# EAGLE design modem_breakout (EAGLE 6.4)
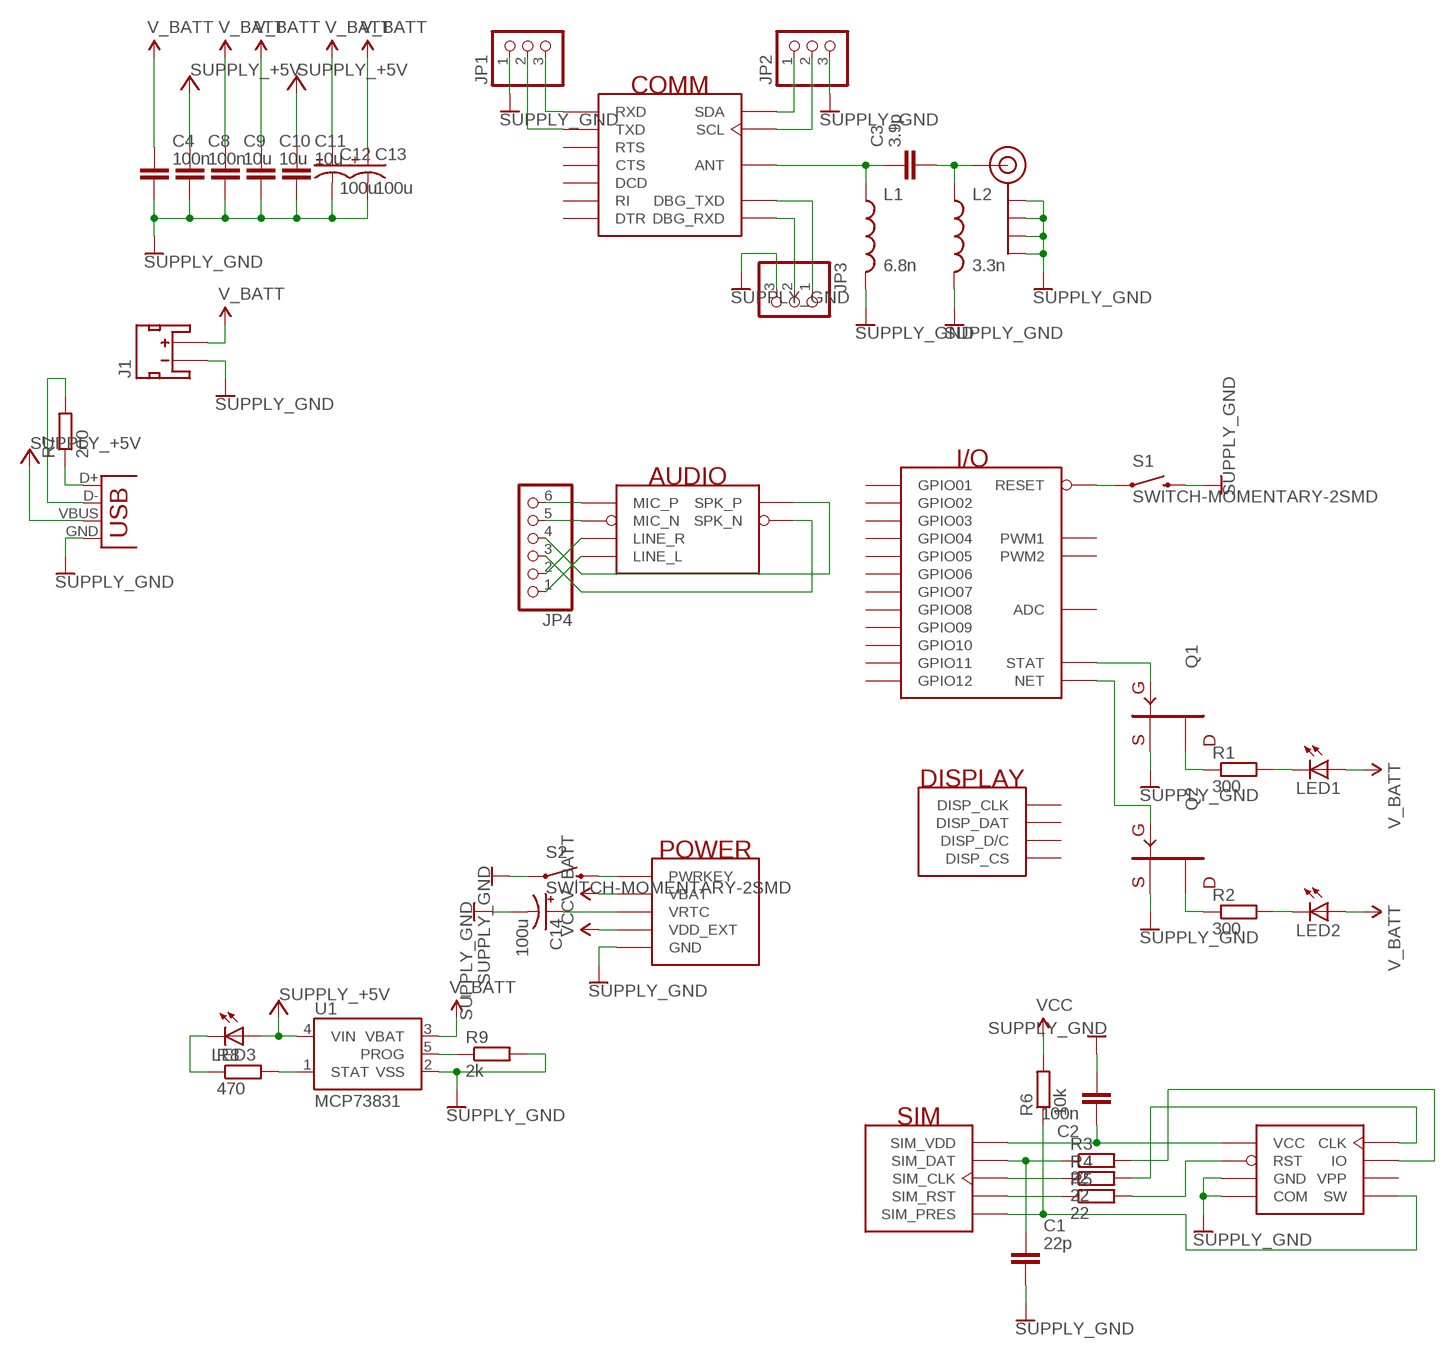
[diagram p0: schematic, sheet 1]

## Parts
C1  22p  CAPACITOR_NPOL-0402  [C402]
C2  100n  CAPACITOR_NPOL-0402  [C402]
C3  3.9p  CAPACITOR_NPOL-0603  [C603]
C4  100n  CAPACITOR_NPOL-0402  [C402]
C8  100n  CAPACITOR_NPOL-0402  [C402]
C9  10u  CAPACITOR_NPOL-0805  [C805]
C10  10u  CAPACITOR_NPOL-0805  [C805]
C11  10u  CAPACITOR_NPOL-0805  [C805]
C12  100u  CAP_POL3528  [EIA3528]
C13  100u  CAP_POL3528  [EIA3528]
C14  100u  CAP_POL3528  [EIA3528]
J1  JST_2MM_MALE  [JST-2-SMD]
J$1  SMA_EDGE  [SMA-EDGE]
JP1  PINHD-1X3  [1X03]
JP2  PINHD-1X3  [1X03]
JP3  PINHD-1X3  [1X03]
JP4  PINHD-1X6  [1X06]
JP5  USB-SMD-NS  [USB-MINIB-NOSTOP]
L1  6.8n  INDUCTOR0603  [0603]
L2  3.3n  INDUCTOR0603  [0603]
LED1  LED-0603  [LED-603]
LED2  LED-0603  [LED-603]
LED3  LED-0603  [LED-603]
Q1  TRANSISTOR_FET-N  [SOT-23]
Q2  TRANSISTOR_FET-N  [SOT-23]
R1  300  RESISTOR-0603  [R603]
R2  300  RESISTOR-0603  [R603]
R3  22  RESISTOR-0402  [R402]
R4  22  RESISTOR-0402  [R402]
R5  22  RESISTOR-0402  [R402]
R6  10k  RESISTOR-0402  [R402]
R7  200  RESISTOR-0603  [R603]
R8  470  RESISTOR-0603  [R603]
R9  2k  RESISTOR-0402  [R402]
S1  SWITCH-MOMENTARY-2SMD  [TACTILE_SWITCH_SMD]
S2  SWITCH-MOMENTARY-2SMD  [TACTILE_SWITCH_SMD]
U1  MCP73831  [SOT23-5]
U$1  SIM900  [SIM900]
U$2  SIM-MICRO  [1041180811]

## Nets
+5V: C8.1 C11.1 JP5.VBUS LED3.A U1.4(VIN) ; supply symbol labelled SUPPLY_+5V
GND: C1.2 C2.2 C4.2 C8.2 C9.2 C10.2 C11.2 C12.C(-) C13.C(-) C14.C(-) J1.1(-) J$1.GND@0(GND) J$1.GND@1(GND) J$1.GND@2(GND) J$1.GND@3(GND) JP1.1 JP2.3 JP3.3 JP5.GND L1.2 L2.2 Q1.2(S) Q2.2(S) R9.2 S1.3 S2.1 U1.2(VSS) U$1.P$17(GND) U$1.P$18(GND) U$1.P$29(GND) U$1.P$39(GND) U$1.P$45(GND) U$1.P$46(GND) U$1.P$53(GND) U$1.P$54(GND) U$1.P$58(GND) U$1.P$59(GND) U$1.P$61(GND) U$1.P$62(GND) U$1.P$63(GND) U$1.P$64(GND) U$1.P$65(GND) U$2.5(GND) U$2.COMMON(COM) U$2.G1(GND) U$2.G2(GND) U$2.G3(GND) U$2.G4(GND) U$2.G5(GND) U$2.G6(GND) ; supply symbol labelled SUPPLY_GND
N$1: JP1.3 U$1.P$10(RXD)
N$2: JP1.2 U$1.P$9(TXD)
N$3: JP2.1 U$1.P$37(SDA)
N$4: JP2.2 U$1.P$38(SCL)
N$5: C3.1 L1.1 U$1.P$60(ANT)
N$6: JP3.1 U$1.P$27(DBG_TXD)
N$7: JP3.2 U$1.P$28(DBG_RXD)
N$8: C3.2 J$1.SIG(SIGNAL) L2.1
N$9: C1.1 R3.1 U$1.P$31(SIM_DAT)
N$10: R6.1 U$1.P$34(SIM_PRES) U$2.DETECT(SW)
N$11: R4.1 U$1.P$32(SIM_CLK)
N$12: R5.1 U$1.P$33(SIM_RST)
N$13: C2.1 U$1.P$30(SIM_VDD) U$2.1(VCC)
N$14: R3.2 U$2.7(IO)
N$15: R4.2 U$2.3(CLK)
N$16: R5.2 U$2.2(RST)
N$17: C14.A(+) U$1.P$26(VRTC)
N$18: Q1.1(G) U$1.P$66(STAT)
N$19: Q2.1(G) U$1.P$52(NET)
N$20: Q2.3(D) R2.1
N$21: Q1.3(D) R1.1
N$22: LED1.C R1.2
N$23: LED2.C R2.2
N$24: S2.3 U$1.P$1(PWRKEY)
N$25: S1.1 U$1.P$16(RESET)
N$26: JP4.2 U$1.P$23(LINE_R)
N$27: JP4.1 U$1.P$24(LINE_L)
N$28: JP4.4 U$1.P$21(SPK_P)
N$29: JP4.3 U$1.P$22(SPK_N)
N$30: JP4.5 U$1.P$20(MIC_N)
N$31: JP4.6 U$1.P$19(MIC_P)
N$32: JP5.D- R7.2
N$33: JP5.D+ R7.1
N$34: LED3.C R8.1
N$35: R8.2 U1.1(STAT)
N$36: R9.1 U1.5(PROG)
V_BATT: C4.1 C9.1 C10.1 C12.A(+) C13.A(+) J1.2(+) LED1.A LED2.A U1.3(VBAT) U$1.P$55(VBAT) U$1.P$56(VBAT) U$1.P$57(VBAT)
VCC: R6.2 U$1.P$15(VDD_EXT)
Unconnected: J1.NC1(PAD1) J1.NC2(PAD2) U$1.P$3(DTR) U$1.P$4(RI) U$1.P$5(DCD) U$1.P$7(CTS) U$1.P$8(RTS) U$1.P$11(DISP_CLK) U$1.P$12(DISP_DAT) U$1.P$13(DISP_D/C) U$1.P$14(DISP_CS) U$1.P$25(ADC) U$1.P$35(PWM1) U$1.P$36(PWM2) U$1.P$40(GPIO01) U$1.P$41(GPIO02) U$1.P$42(GPIO03) U$1.P$43(GPIO04) U$1.P$44(GPIO05) U$1.P$47(GPIO06) U$1.P$48(GPIO07) U$1.P$49(GPIO08) U$1.P$50(GPIO09) U$1.P$51(GPIO10) U$1.P$67(GPIO11) U$1.P$68(GPIO12) U$2.6(VPP)

## Library data of the parts
C1-C4 C8-C11 = dp_devices:CAPACITOR_NPOL: Non-Polarized capacitor in various packages
C12-C14 = SparkFun-Capacitors:CAP_POL: Capacitor Polarized These are standard SMD and PTH capacitors. Normally 10uF, 47uF, and 100uF in electrolytic and tantalum varieties. Always verify the external diameter of the through hole cap, it varies with capacity, voltage, and manufacturer. The EIA devices should be standard.
J1 = SparkFun-Connectors:JST_2MM_MALE: Mates to single-cell LiPo batteries. CONN-08352; PROD_ID: CONN-08352
J$1 = SparkFun-Connectors:SMA_EDGE: SMA Antenna Connector End launch SMA connector. The paste layer has been removed so that the connector can be hand soldered onto the board after reflow.
JP1-JP3 = pinhead:PINHD-1X3: PIN HEADER
JP4 = pinhead:PINHD-1X6: PIN HEADER
JP5 = SparkFun-Connectors:USB: USB Connectors USB-B-PTH is fully proven SKU : PRT-00139/CONN-08278 USB-miniB is fully proven SKU : PRT-00587 USB-A-PCB is untested. USB-A-H is throughly reviewed, but untested. Spark Fun Electronics SKU : PRT-00437 USB-B-SMT is throughly reviewed, but untested. Needs silkscreen touching up. USB-A-S has not been used/tested USB-MB-H has not been used/tested USB-MICROB has been used. CONN-09505
L1 L2 = SparkFun-Passives:INDUCTOR: Inductors Basic Inductor/Choke - 0603 and 1206. Footprints are not proven and vary greatly between part numbers.
LED1-LED3 = dp_devices:LED: Light Emitting Diode
Q1 Q2 = dp_devices:TRANSISTOR_FET-N
R1-R9 = dp_devices:RESISTOR
S1 S2 = SparkFun-Electromechanical:SWITCH-MOMENTARY-2: Various NO switches- pushbuttons, reed, etc
U1 = SparkFun-PowerIC:MCP73831: Miniature single cell, fully integrated Li-Ion, Li-polymer charge management controller http://ww1.microchip.com/downloads/en/DeviceDoc/21984a.pdf IC-09995; PROD_ID: IC-09995
U$1 = customParts:SIM900
U$2 = customParts:SIM

## Board
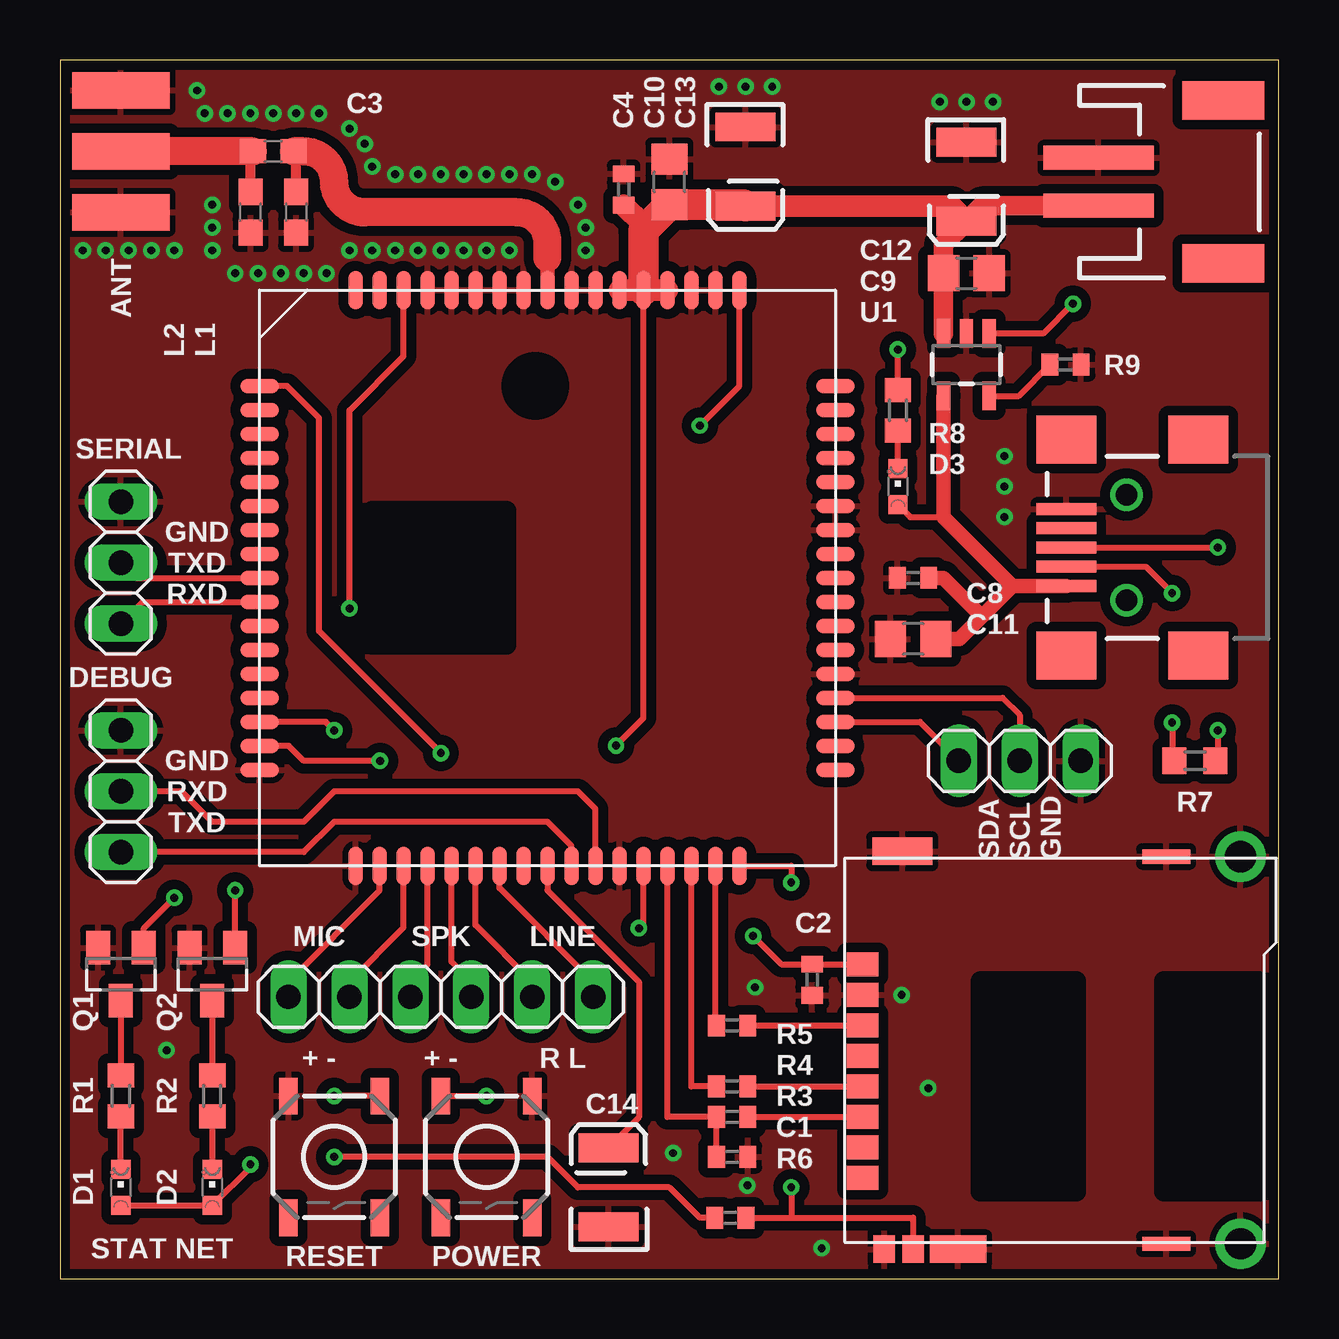
[diagram p1: board, top side]
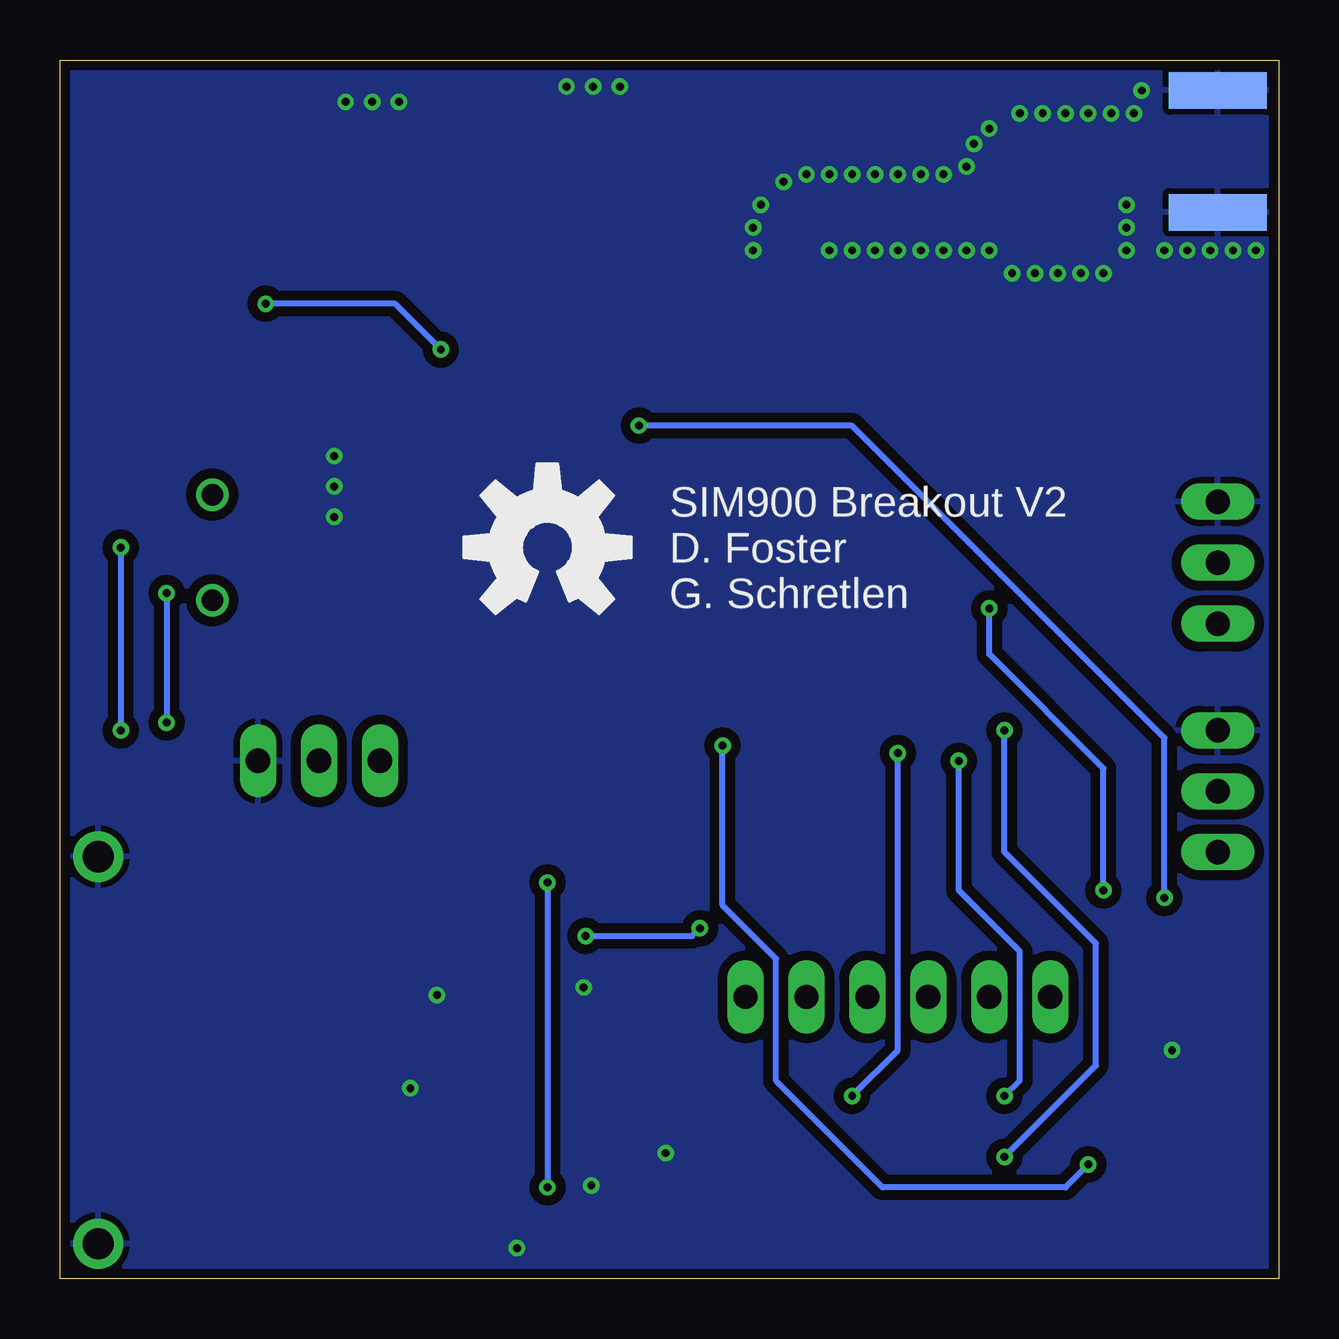
[diagram p2: board, bottom side, seen from below]

Size 50.8 x 50.8 mm. Coordinates in mm from the lower left corner, seen from the top.
Outline: 0,0 50.8,0 50.8,50.8 0,50.8 0,0
Copper layers (1*16): Top 0.0356mm / dielectric 1.5011mm / Bottom 0.0356mm
Design rules "LaenPCBOrder *": minimum track width 6mil, minimum drill 13mil, track to track 6mil, track to pad 6mil, pad to pad 6mil, via to via 6mil, smd to smd 6mil, copper to edge 15mil, drill to drill 6mil, minimum pad ring 7mil, minimum via ring 7mil, stop-mask expansion 4mil, vias tented up to drill 15mil, thermal gap 10mil

### Footprints (pad centres in the part's own frame; a part is rotated, then mirrored left to right if it is on the bottom)
C402 = smd 0.7 x 0.9: 1 -0.65,0; 2 0.65,0
C603 = smd 1.1 x 1: 1 -0.85,0; 2 0.85,0
C805 = smd 1.3 x 1.5: 1 -0.95,0; 2 0.95,0
EIA3528 = smd 1.2 x 2.5: A 1.65,0; C -1.65,0
JST-2-SMD = smd 1 x 4.6: 1 -1,-3.7; 2 1,-3.7 | smd 1.6 x 3.4: NC1 -3.4,1.5; NC2 3.4,1.5
SMA-EDGE = smd 1.524 x 4.064: GND@0 0,0; GND@1 5.08,0; SIG 2.54,0 | smd 1.524 x 4.064 bottom: GND@2 0,0; GND@3 5.08,0
1X03 = drill 1.016 long: 1 -2.54,0; 2 0,0; 3 2.54,0
1X06 = drill 1.016 long: 1 -6.35,0; 2 -3.81,0; 3 -1.27,0; 4 1.27,0; 5 3.81,0; 6 6.35,0
USB-MINIB-NOSTOP = smd 2.5 x 0.5: D+ 2.5,0; D- 2.5,0.8; GND 2.5,-1.6; ID 2.5,-0.8; VBUS 2.5,1.6 | smd 2.5 x 2: G1 -3,-4.5; G2 -3,4.5; G3 2.5,4.5; G4 2.5,-4.5 | drill 0.9 pad 0.8: H1 0,2.2 | drill 0.9 pad 0.787: H2 0,-2.2
0603 = smd 1.1 x 1: 1 -0.85,0; 2 0.85,0
LED-603 = smd 0.8 x 0.8: A 0,-0.75; C 0,0.75
SOT-23 = smd 1 x 1.4: 1 -0.95,-1.1; 2 0.95,-1.1; 3 0,1.1
R603 = smd 1 x 1.1: 1 -0.85,0; 2 0.85,0
R402 = smd 0.7 x 0.9: 1 -0.65,0; 2 0.65,0
TACTILE_SWITCH_SMD = smd 1.524 x 0.762: 1 -2.54,1.905; 2 2.54,1.905; 3 -2.54,-1.905; 4 2.54,-1.905
SOT23-5 = smd 0.55 x 1.2: 1 -0.95,-1.3; 2 0,-1.3; 3 0.95,-1.3; 4 0.95,1.3; 5 -0.95,1.3
SIM900 = smd 1.6 x 0.6: P$1 -12,8; P$2 -12,7; P$3 -12,6; P$4 -12,5; P$5 -12,4; P$6 -12,3; P$7 -12,2; P$8 -12,1; P$9 -12,0; P$10 -12,-1; P$11 -12,-2; P$12 -12,-3; P$13 -12,-4; P$14 -12,-5; P$15 -12,-6; P$16 -12,-7; P$17 -12,-8; P$35 12,-8; P$36 12,-7; P$37 12,-6; P$38 12,-5; P$39 12,-4; P$40 12,-3; P$41 12,-2; P$42 12,-1; P$43 12,0; P$44 12,1; P$45 12,2; P$46 12,3; P$47 12,4; P$48 12,5; P$49 12,6; P$50 12,7; P$51 12,8 | smd 0.6 x 1.6: P$18 -8,-12; P$19 -7,-12; P$20 -6,-12; P$21 -5,-12; P$22 -4,-12; P$23 -3,-12; P$24 -2,-12; P$25 -1,-12; P$26 0,-12; P$27 1,-12; P$28 2,-12; P$29 3,-12; P$30 4,-12; P$31 5,-12; P$32 6,-12; P$33 7,-12; P$34 8,-12; P$52 8,12; P$53 7,12; P$54 6,12; P$55 5,12; P$56 4,12; P$57 3,12; P$58 2,12; P$59 1,12; P$60 0,12; P$61 -1,12; P$62 -2,12; P$63 -3,12; P$64 -4,12; P$65 -5,12; P$66 -6,12; P$67 -7,12; P$68 -8,12
1041180811 = smd 1 x 1.3: 1 3.57,7.5; 2 1.03,7.5; 3 -1.51,7.5; 4 -4.05,7.5; 5 2.3,7.5; 6 -0.24,7.5; 7 -2.78,7.5; 8 -5.32,7.5 | smd 1.15 x 0.9: COMMON -8.295,6.6; DETECT -8.295,5.4 | drill 1.3 pad 2.1: G1 -8.07,-8.25; G6 8.07,-8.25 | smd 0.6 x 2: G2 -8.07,-5.15; G5 8.07,-5.15 | smd 1.15 x 2.35: G3 -8.295,3.525 | smd 1.15 x 2.5: G4 8.295,5.85

### Placement (x,y rotation side)
C1  28.02,5.08 0 top
C2  31.35,12.46 270 top
C3  8.89,46.99 180 top
C4  23.5,45.4 90 top
C8  35.56,29.21 180 top
C9  37.78,41.91 0 top
C10  25.4,45.72 90 top
C11  35.56,26.67 180 top
C12  37.78,45.72 270 top
C13  28.57,46.35 270 top
C14  22.86,3.81 90 top
J1  46.99,45.72 270 top
J$1  2.54,44.45 90 top
JP1  2.54,29.84 270 top
JP2  40.01,21.59 0 top
JP3  2.54,20.32 90 top
JP4  15.88,11.75 180 top
JP5  44.45,30.48 180 top
L1  9.84,44.45 270 top
L2  7.94,44.45 270 top
LED1  6.35,3.81 0 top
LED2  2.54,3.81 0 top
LED3  34.92,33.02 0 top
Q1  6.35,12.7 180 top
Q2  2.54,12.7 180 top
R1  6.35,7.62 270 top
R2  2.54,7.62 270 top
R3  28.02,6.75 0 top
R4  28.02,8.02 0 top
R5  28.02,10.56 0 top
R6  27.94,2.54 180 top
R7  47.31,21.59 180 top
R8  34.92,36.2 90 top
R9  41.91,38.1 0 top
S1  11.43,5.08 270 top
S2  17.78,5.08 270 top
U1  37.78,38.1 180 top
U$1  20.32,29.21 0 top
U$2  40.96,9.53 90 top
U$3  [OSHW-LOGO-L]  30.48,30.48 0 bottom

### Tracks (layer width: path | path; a pad name or v marks a point on that pad's centre or on a via)
+5V
  Top 0.254: LED3.A 35.45,31.75 36.83,31.75
  Top 0.61: JP5.VBUS 39.7,28.88 | 39.7,28.88 36.83,31.75 U1.4 | 39.7,28.88 38.43,27.61 | 38.43,27.61 37.49,26.67 C11.1 | C8.1 36.83,29.21 38.43,27.61
GND  (via drill 0.33)
  other vias: 5.71,49.53 6.03,48.58 6.99,48.58 7.94,48.58 8.89,48.58 9.84,48.58 10.79,48.58 12.06,47.94 12.7,47.31 13.02,46.35 13.97,46.04 14.92,46.04 15.88,46.04 16.83,46.04 17.78,46.04 18.73,46.04 19.68,46.04 20.64,45.72 21.59,44.77 21.91,43.81 21.91,42.86 6.35,44.77 6.35,43.81 6.35,42.86 4.76,42.86 3.81,42.86 2.86,42.86 1.91,42.86 0.95,42.86 7.3,41.91 8.26,41.91 9.21,41.91 10.16,41.91 11.11,41.91 12.06,42.86 13.02,42.86 13.97,42.86 14.92,42.86 15.88,42.86 16.83,42.86 17.78,42.86 18.73,42.86 39.37,31.75 39.37,33.02 39.37,34.29 36.2,7.94 31.75,1.27 4.45,9.53 25.56,5.24 28.65,3.89 28.97,12.14 35.08,11.83 27.46,49.69 28.57,49.69 29.69,49.69 36.67,49.05 37.78,49.05 38.89,49.05
  pour Bottom (isolate 0.406): 0,0 50.8,0 50.8,50.8 0,50.8
  pour Top (isolate 0.406): 0,0 50.8,0 50.8,50.8 0,50.8
N$1
  Top 0.254: JP1.3 3.44,28.21 U$1.P$10
N$2
  Top 0.254: JP1.2 3.17,29.21 U$1.P$9
N$3
  Top 0.254: U$1.P$37 35.84,23.21 JP2.1
N$4
  Top 0.254: U$1.P$38 39.29,24.21 40.01,23.5 JP2.2
N$5
  Top 0.406: L1.1 9.84,46.89 arc90 C3.1
  Top 0.61: U$1.P$60 20.32,42.55
  Top 1.168: 20.32,42.55 20.32,43.18 arc90 19.05,44.45 12.7,44.45 arc-90 11.43,45.72 arc90 10.16,46.99 C3.1
N$6
  Top 0.254: U$1.P$27 21.32,18.05 20.32,19.05 11.43,19.05 10.16,17.78 JP3.1
N$7
  Top 0.254: U$1.P$28 22.32,19.59 21.59,20.32 11.43,20.32 10.16,19.05 6.35,19.05 5.08,20.32 JP3.2
N$8
  Top 0.406: L2.1 7.94,46.89 arc-90 C3.2
  Top 1.168: C3.2 J$1.SIG
N$9
  Top 0.254: C1.1 R3.1 25.32,6.75 U$1.P$31
N$10  (via drill 0.33)
  Top 0.254: R6.1 30.48,2.54 | U$1.P$34 30.48,17.21 v30.48,16.51 | v30.48,3.81 30.48,2.54 | 30.48,2.54 35.56,2.54 U$2.DETECT
  Bottom 0.254: v30.48,16.51 v30.48,3.81
N$11
  Top 0.254: R4.1 26.32,8.02 U$1.P$32
N$12
  Top 0.254: R5.1 27.32,10.56 U$1.P$33
N$13  (via drill 0.33)
  Top 0.254: v24.13,14.61 24.32,14.79 U$1.P$30 | v28.89,14.29 30.07,13.11 C2.1 31.37,13.1 U$2.1
  Bottom 0.254: v28.89,14.29 24.45,14.29 v24.13,14.61
N$14
  Top 0.254: R3.2 U$2.7
N$15
  Top 0.254: R4.2 U$2.3
N$16
  Top 0.254: R5.2 U$2.2
N$17
  Top 0.254: U$1.P$26 20.32,16.19 24.13,12.38 24.13,6.73 C14.A
N$18  (via drill 0.33)
  Top 0.254: Q1.1 v7.3,16.19 | v12.06,27.94 12.06,36.2 14.32,38.45 U$1.P$66
  Bottom 0.254: v7.3,16.19 7.3,21.27 12.06,26.04 v12.06,27.94
N$19  (via drill 0.33)
  Top 0.254: Q2.1 3.49,14.6 v4.76,15.88 | v26.67,35.56 28.32,37.21 U$1.P$52
  Bottom 0.254: v4.76,15.88 4.76,22.54 17.78,35.56 v26.67,35.56
N$20
  Top 0.254: Q2.3 R2.1
N$21
  Top 0.254: Q1.3 R1.1
N$22
  Top 0.254: R1.2 LED1.C
N$23
  Top 0.254: LED2.C R2.2
N$24  (via drill 0.33)
  Top 0.254: S2.3 v17.78,7.62 | v15.88,21.91 10.79,26.99 10.79,35.88 9.46,37.21 U$1.P$1
  Bottom 0.254: v17.78,7.62 15.88,9.53 v15.88,21.91
N$25  (via drill 0.33)
  Top 0.254: S1.1 v11.43,7.62 | v13.34,21.59 10.16,21.59 9.54,22.21 U$1.P$16
  Bottom 0.254: v11.43,7.62 10.79,8.26 10.79,13.65 13.34,16.19 v13.34,21.59
N$26
  Top 0.254: JP4.2 19.68,12.38 17.32,14.75 U$1.P$23
N$27
  Top 0.254: JP4.1 22.23,12.38 18.32,16.29 U$1.P$24
N$28
  Top 0.254: JP4.4 14.61,12.38 15.32,13.1 U$1.P$21
N$29
  Top 0.254: JP4.3 17.14,12.38 16.32,13.21 U$1.P$22
N$30
  Top 0.254: JP4.5 12.06,12.38 14.32,14.64 U$1.P$20
N$31
  Top 0.254: JP4.6 9.53,12.38 13.32,16.18 U$1.P$19
N$32  (via drill 0.33)
  Top 0.254: JP5.D- 45.25,29.68 v46.35,28.57 | v46.35,23.18 46.35,21.69 R7.2
  Bottom 0.254: v46.35,28.57 v46.35,23.18
N$33  (via drill 0.33)
  Top 0.254: JP5.D+ v48.26,30.48 | v48.26,22.86 48.26,21.69 R7.1
  Bottom 0.254: v48.26,30.48 v48.26,22.86
N$34
  Top 0.254: LED3.C R8.1
N$35  (via drill 0.33)
  Top 0.254: R8.2 v34.92,38.73 | v42.23,40.64 40.99,39.4 U1.1
  Bottom 0.254: v34.92,38.73 36.83,40.64 v42.23,40.64
N$36
  Top 0.254: U1.5 39.96,36.8 R9.1
V_BATT  (via drill 0.33)
  Top 0.254: LED2.A LED1.A 7.94,4.65 v7.94,4.76 | v23.18,22.23 24.32,23.37 U$1.P$56
  Top 0.813: U1.3 C9.1 36.83,43.12 C12.A 38.43,44.72 J1.2
  Top 0.889: U$1.P$57 U$1.P$56 U$1.P$55 | C4.1 24.27,43.98 24.61,43.98 | C13.A 37.15,44.7 C12.A
  Top 1.27: C13.A 28.51,44.77 C10.1 24.61,43.98 24.32,43.69 U$1.P$56
  Bottom 0.254: v7.94,4.76 8.89,3.81 16.51,3.81 20.95,8.26 20.95,13.34 23.18,15.56 v23.18,22.23
VCC  (via drill 0.33)
  Top 0.254: R6.2 26.67,2.54 25.4,3.81 21.59,3.81 20.32,5.08 v11.43,5.08 | v11.43,22.86 11.08,23.21 U$1.P$15
  Bottom 0.254: v11.43,5.08 7.62,8.89 7.62,13.97 11.43,17.78 v11.43,22.86

### Text on the board
tPlace: C3 | C4 / C10 / C13 | ANT | C12 / C9 / U1 | L2 / L1 | R9 | SERIAL | R8 / D3 | GND / TXD / RXD | C8 / C11 | DEBUG | GND / RXD / TXD | R7 | SDA / SCL / GND | C2 | MIC | SPK | LINE | Q1 | Q2 | + - | + - | R L | R1 | R2 | R5 / R4 / R3 / C1 / R6 | C14 | D1 | D2 | STAT NET | RESET | POWER
bPlace: SIM900 Breakout V2 / D. Foster / G. Schretlen